# EAGLE schematic manual_slave (EAGLE 9.2.0)
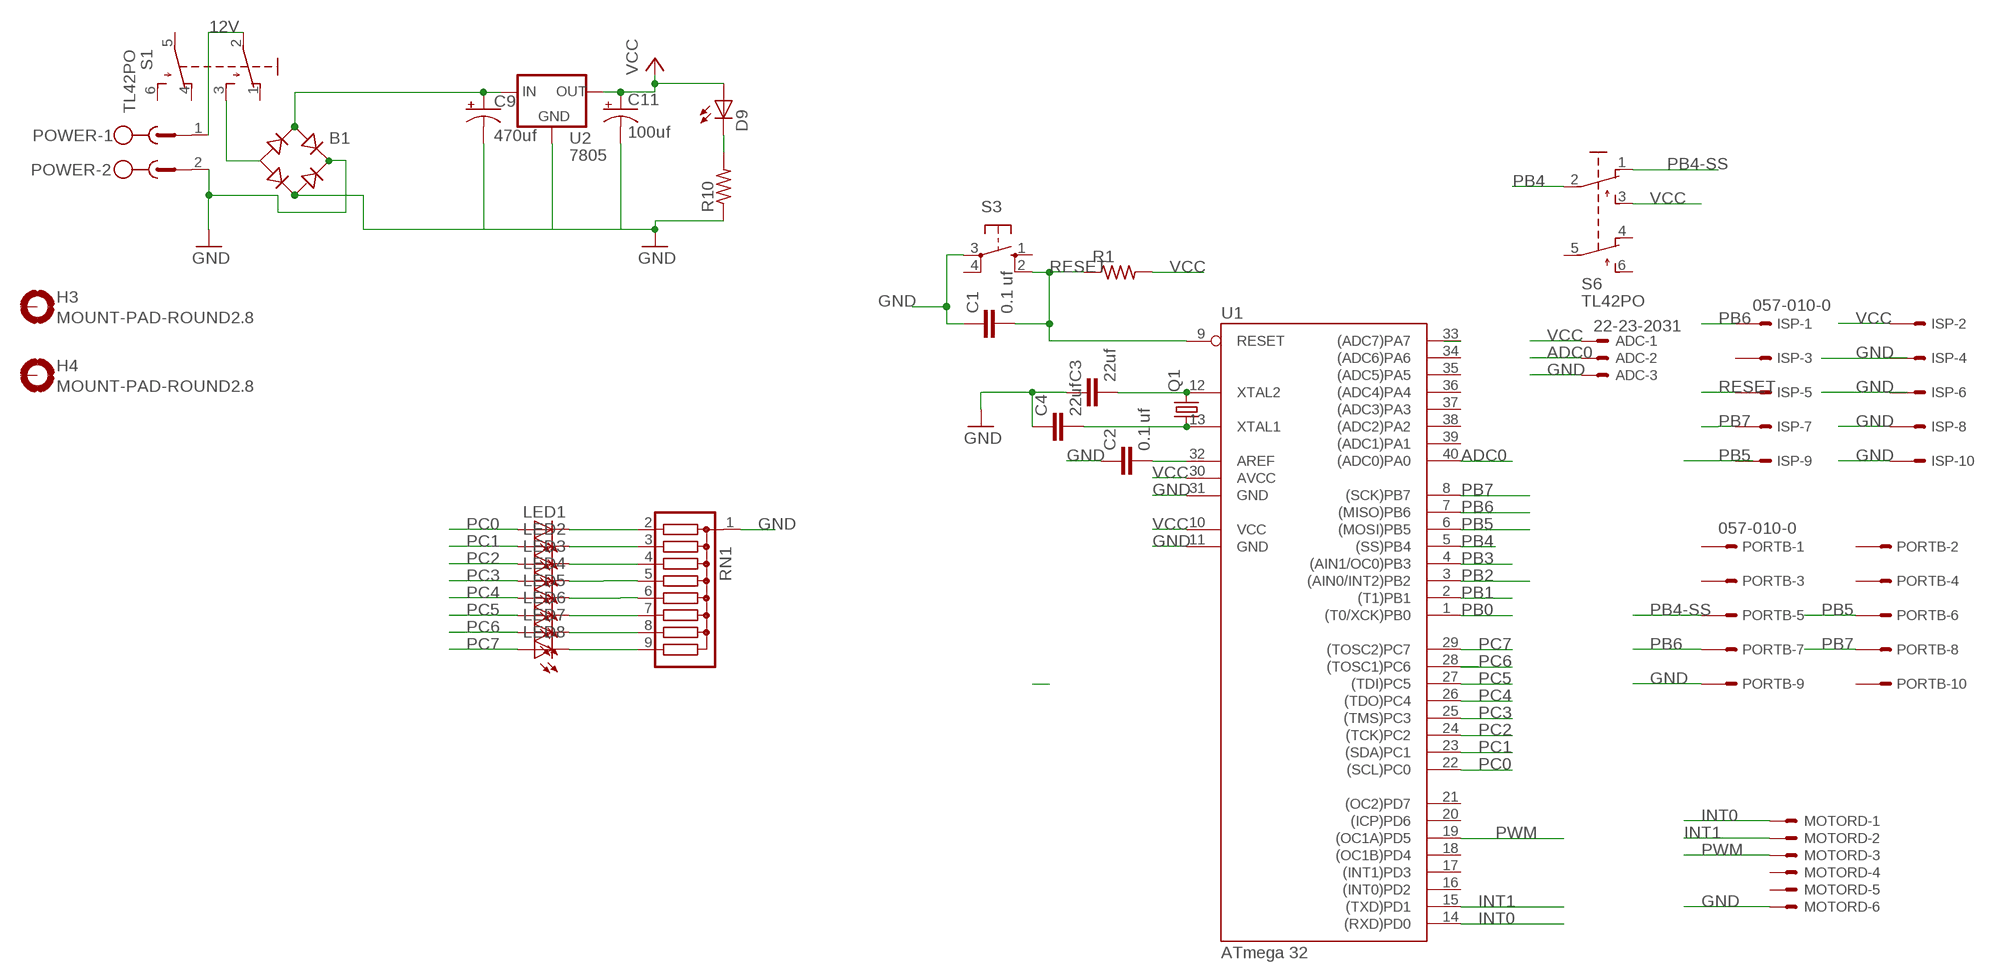
[diagram p0: schematic, sheet 1]

## Parts
ADC  22-23-2031  [22-23-2031]
B1  RB1A  [RB1A]
C1  0.1 uf  C-EU025-024X044  [C025-024X044]
C2  0.1 uf  C-EU025-024X044  [C025-024X044]
C3  22uf  C-EU025-024X044  [C025-024X044]
C4  22uf  C-EU025-024X044  [C025-024X044]
C9  470uf  CPOL-USE2-4  [E2-4]
C11  100uf  CPOL-USE2-4  [E2-4]
D9  LED3MM  [LED3MM]
H3  MOUNT-PAD-ROUND2.8  [2,8-PAD]
H4  MOUNT-PAD-ROUND2.8  [2,8-PAD]
ISP  057-010-0  [057-010-0]
LED1  LED3MM  [LED3MM]
LED2  LED3MM  [LED3MM]
LED3  LED3MM  [LED3MM]
LED4  LED3MM  [LED3MM]
LED5  LED3MM  [LED3MM]
LED6  LED3MM  [LED3MM]
LED7  LED3MM  [LED3MM]
LED8  LED3MM  [LED3MM]
MOTORD  22-23-2061  [22-23-2061]
PORTB  057-010-0  [057-010-0]
POWER  MSTBV2  [MSTBV2]
Q1  CRYSTALHC18U-V  [HC18U-V]
R1  R-US_0204/7  [0204/7]
R10  R-US_0204/7  [0204/7]
RN1  G08R  [SIL9]
S1  TL42PO  [TL4XPO]
S3  10-XX  [B3F-10XX]
S6  TL42PO  [TL4XPO]
U1  ATmega 32  MEGA32-P  [DIL40]
U2  7805  78XXL  [78XXL]

## Nets
12V: POWER.1 S1.2(P)
ADC0: ADC.2 U1.40((ADC0)PA0)
GND: ADC.3 B1.+ B1.AC2 C1.1 C2.1 C3.1 C4.1 C9.- C11.- ISP.4 ISP.6 ISP.8 ISP.10 MOTORD.6 PORTB.9 POWER.2 R10.1 RN1.1 S3.3(P) U1.11(GND) U1.31(GND) U2.GND
INT0: MOTORD.1 U1.14((RXD)PD0)
INT1: MOTORD.2 U1.15((TXD)PD1)
N$2: B1.- S1.3(S)
N$3: C3.2 Q1.2 U1.12(XTAL2)
N$4: C4.2 Q1.1 U1.13(XTAL1)
N$6: C2.2 U1.32(AREF)
N$7: D9.K(C) R10.2
N$9: LED1.K(C) RN1.2
N$10: LED2.K(C) RN1.3
N$11: LED3.K(C) RN1.4
N$12: LED4.K(C) RN1.5
N$13: LED5.K(C) RN1.6
N$14: LED6.K(C) RN1.7
N$15: LED7.K(C) RN1.8
N$16: LED8.K(C) RN1.9
N$23: B1.AC1 C9.+ U2.IN
PA7: U1.33((ADC7)PA7)
PB0: U1.1((T0/XCK)PB0)
PB1: U1.2((T1)PB1)
PB2: U1.3((AIN0/INT2)PB2)
PB3: U1.4((AIN1/OC0)PB3)
PB4: S6.2(P) U1.5((SS)PB4)
PB4-SS: PORTB.5 S6.1(O)
PB5: ISP.9 PORTB.6 U1.6((MOSI)PB5)
PB6: ISP.1 PORTB.7 U1.7((MISO)PB6)
PB7: ISP.7 PORTB.8 U1.8((SCK)PB7)
PC0: LED1.A U1.22((SCL)PC0)
PC1: LED2.A U1.23((SDA)PC1)
PC2: LED3.A U1.24((TCK)PC2)
PC3: LED4.A U1.25((TMS)PC3)
PC4: LED5.A U1.26((TDO)PC4)
PC5: LED6.A U1.27((TDI)PC5)
PC6: LED7.A U1.28((TOSC1)PC6)
PC7: LED8.A U1.29((TOSC2)PC7)
PWM: MOTORD.3 U1.19((OC1A)PD5)
RESET: C1.2 ISP.5 R1.1 S3.2(S1) U1.9(RESET)
VCC: ADC.1 C11.+ D9.A ISP.2 R1.2 S6.3(S) U1.10(VCC) U1.30(AVCC) U2.OUT
Unconnected: H3.B2,8(MOUNT) H4.B2,8(MOUNT) ISP.3 MOTORD.4 MOTORD.5 PORTB.1 PORTB.2 PORTB.3 PORTB.4 PORTB.10 S1.1(O) S1.4(O1) S1.5(P1) S1.6(S1) S3.1(S) S3.4(P1) S6.4(O1) S6.5(P1) S6.6(S1) U1.16((INT0)PD2) U1.17((INT1)PD3) U1.18((OC1B)PD4) U1.20((ICP)PD6) U1.21((OC2)PD7) U1.34((ADC6)PA6) U1.35((ADC5)PA5) U1.36((ADC4)PA4) U1.37((ADC3)PA3) U1.38((ADC2)PA2) U1.39((ADC1)PA1)

## Library data of the parts
ADC = con-molex:22-23-2031: .100" (2.54mm) Center Header - 3 Pin; MF: MOLEX; MPN: 22-23-2031; OC_FARNELL: 1462950; OC_NEWARK: 30C0862
B1 = rectifier:RB1A: RECTIFIER 1 A
C1-C4 = rcl:C-EU: CAPACITOR, European symbol
C9 C11 = rcl:CPOL-US: POLARIZED CAPACITOR, American symbol; SPICEPREFIX: C
D9 LED1-LED8 = led:LED: LED OSRAM: - CHIPLED LG R971, LG N971, LY N971, LG Q971, LY Q971, LO R971, LY R971 LH N974, LH R974 LS Q976, LO Q976, LY Q976 LO Q996 - Hyper CHIPLED LW Q18S LB Q993, LB Q99A, LB R99A - SideLED LS A670, LO A670, LY A670, LG A670, LP A670 LB A673, LV A673, LT A673, LW A673 LH A674 LY A675 LS A676, LA A676, LO A676, LY A676, LW A676 LS A679, LY A679, LG A679 - Hyper Micro SIDELED® LS Y876, LA Y876, LO Y876, LY Y876 LT Y87S - SmartLED LW L88C, LW L88S LB L89C, LB L89S, LG L890 LS L89K, LO L89K, LY L89K LS L896, LA L896, LO L896, LY L896 - TOPLED LS T670, LO T670, LY T670, LG T670, LP T670 LSG T670, LSP T670, LSY T670, LOP T670, LYG T670 LG T671, LOG T671, LSG T671 LB T673, LV T673, LT T673, LW T673 LH T674 LS T676, LA T676, LO T676, LY T676, LB T676, LH T676, LSB T676, LW T676 LB T67C, LV T67C, LT T67C, LS T67K, LO T67K, LY T67K, LW E67C LS E67B, LA E67B, LO E67B, LY E67B, LB E67C, LV E67C, LT E67C LW T67C LS T679, LY T679, LG T679 LS T770, LO T770, LY T770, LG T770, LP T770 LB T773, LV T773, LT T773, LW T773 LH T774 LS E675, LA E675, LY E675, LS T675 LS T776, LA T776, LO T776, LY T776, LB T776 LHGB T686 LT T68C, LB T68C - Hyper Mini TOPLED® LB M676 - Mini TOPLED Santana® LG M470 LS M47K, LO M47K, LY M47K Source: http://www.osram.convergy.de LUXEON: - LUMILED® LXK2-PW12-R00, LXK2-PW12-S00, LXK2-PW14-U00, LXK2-PW14-V00 LXK2-PM12-R00, LXK2-PM12-S00, LXK2-PM14-U00 LXK2-PE12-Q00, LXK2-PE12-R00, LXK2-PE12-S00, LXK2-PE14-T00, LXK2-PE14-U00 LXK2-PB12-K00, LXK2-PB12-L00, LXK2-PB12-M00, LXK2-PB14-N00, LXK2-PB14-P00, LXK2-PB14-Q00 LXK2-PR12-L00, LXK2-PR12-M00, LXK2-PR14-Q00, LXK2-PR14-R00 LXK2-PD12-Q00, LXK2-PD12-R00, LXK2-PD12-S00 LXK2-PH12-R00, LXK2-PH12-S00 LXK2-PL12-P00, LXK2-PL12-Q00, LXK2-PL12-R00 Source: www.luxeon.com KINGBRIGHT: KA-3528ASYC Source: www.kingbright.com
H3 H4 = holes:MOUNT-PAD-ROUND: MOUNTING PAD, round
ISP PORTB = con-panduit:057-010-: CONNECTOR 10-pin series 057 contact pc board low profile headers; OC_FARNELL: unknown; OC_NEWARK: unknown
MOTORD = con-molex:22-23-2061: .100" (2.54mm) Center Header - 6 Pin; MF: MOLEX; MPN: 22-23-2061; OC_FARNELL: 1462922; OC_NEWARK: 27C1933
POWER = con-phoenix-500:MSTBV2: PHOENIX; OC_FARNELL: unknown; OC_NEWARK: unknown
Q1 = crystal:CRYSTAL: CRYSTAL; OC_FARNELL: unknown; OC_NEWARK: unknown
R1 R10 = resistor:R-US_: RESISTOR, American symbol
RN1 = resistor-sil:G08R: SIL RESISTOR; OC_FARNELL: unknown; OC_NEWARK: unknown
S1 S6 = switch:TL42PO: TINY SWITCH ON - MOM Source: http://www2.produktinfo.conrad.com/datenblaetter/700000-724999/705152-da-01-de-Subminiaturschalter_TL_36YO.pdf
S3 = switch-omron:10-XX: OMRON SWITCH; MPN: B3F-1000; OC_FARNELL: 176432; OC_NEWARK: 36M3542
U1 = atmel:MEGA32-P: MICROCONTROLLER 32 Kbytes FLASH 2 Kbytes SRAM 1 Kbytes EEPROM USART 8-channel 10 bit ADC Source: www.atmel.com .. doc2503.pdf; MPN: ATMEGA32-16PU; OC_FARNELL: 1661729; OC_NEWARK: 51P1794
U2 = v-reg:78XXL: VOLTAGE REGULATOR